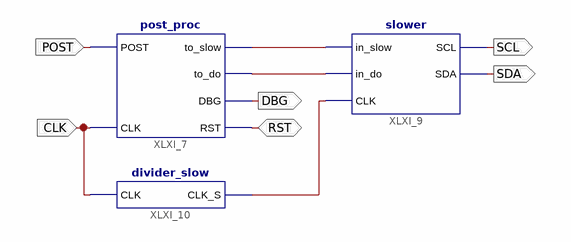
[diagram p0: schematic sheet 1]
// Xilinx ISE schematic overall.sch (xbr) as structural Verilog: 3 symbols, 6 ports
module overall (
  input  POST,
  input  CLK,
  inout  RST,
  output DBG,
  output SCL,
  output SDA
);

  wire XLXN_109, XLXN_110, XLXN_111;

  post_proc XLXI_7 (.POST(POST), .to_slow(XLXN_110), .RST(RST), .DBG(DBG), .to_do(XLXN_111), .CLK(CLK));
  divider_slow XLXI_10 (.CLK(CLK), .CLK_S(XLXN_109));
  slower XLXI_9 (.SCL(SCL), .SDA(SDA), .in_do(XLXN_111), .in_slow(XLXN_110), .CLK(XLXN_109));
endmodule
